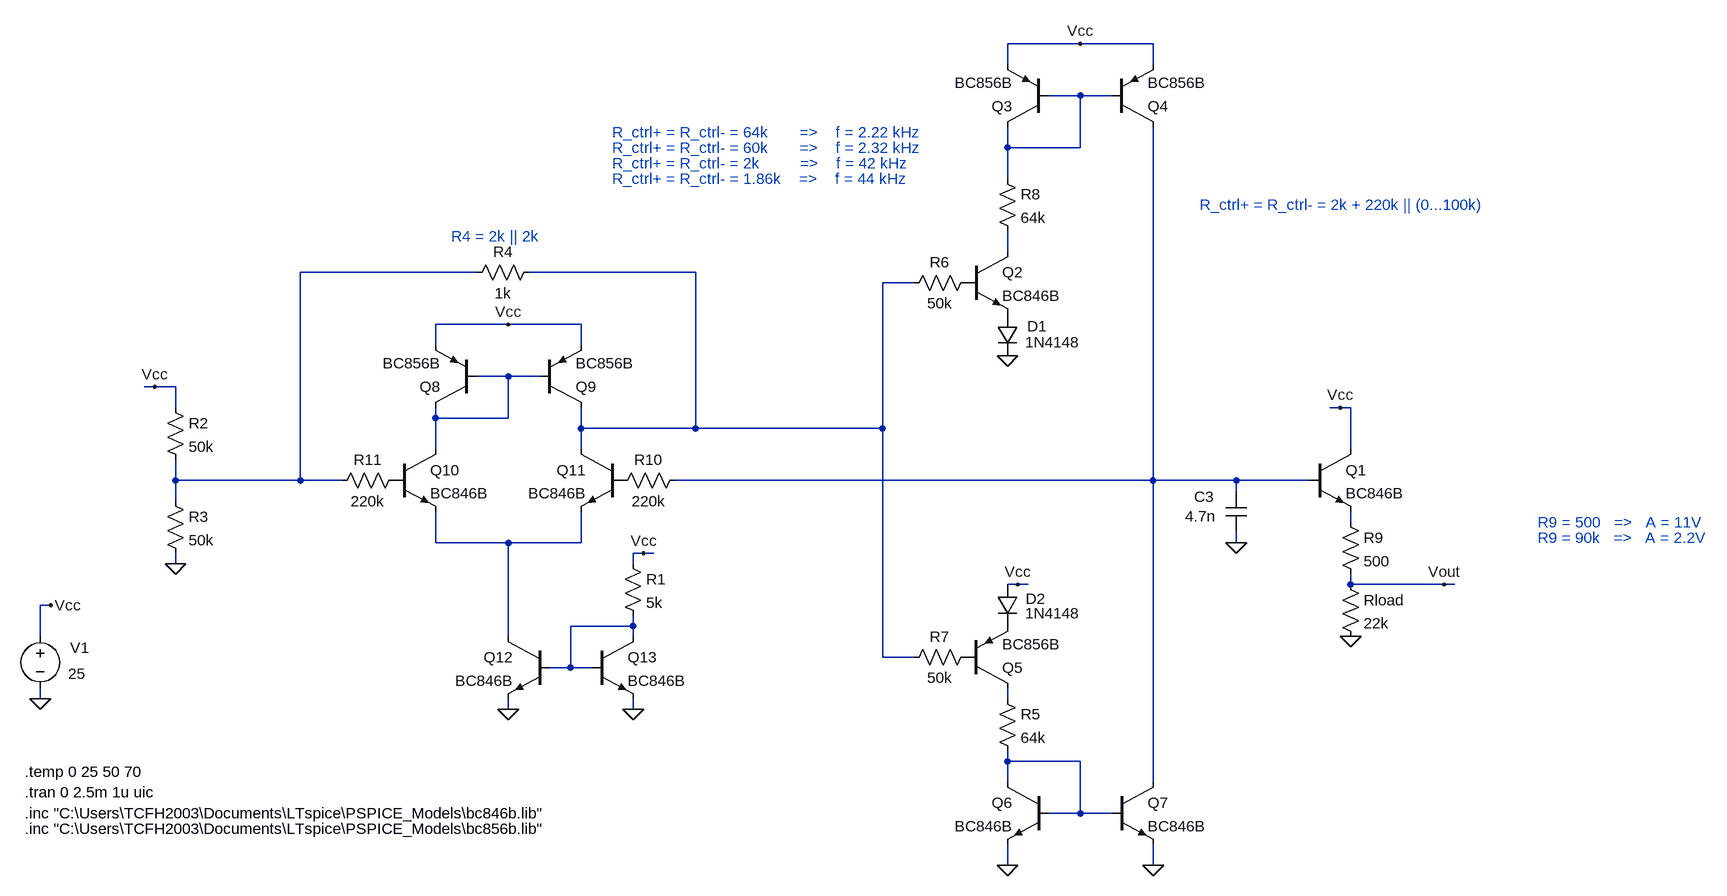
[diagram p0: schematic Proiect1_v5.asc]
Proiect1_v5.asc, the LTspice schematic file:
Version 4
SHEET 1 2096 956
WIRE 1088 -928 976 -928
WIRE 1200 -928 1088 -928
WIRE 976 -896 976 -928
WIRE 1200 -896 1200 -928
WIRE 1088 -848 1040 -848
WIRE 1136 -848 1088 -848
WIRE 976 -768 976 -800
WIRE 1088 -768 1088 -848
WIRE 1088 -768 976 -768
WIRE 976 -720 976 -768
WIRE 976 -608 976 -640
WIRE 160 -576 -112 -576
WIRE 496 -576 240 -576
WIRE 832 -560 784 -560
WIRE 208 -496 96 -496
WIRE 320 -496 208 -496
WIRE 96 -464 96 -496
WIRE 320 -464 320 -496
WIRE 208 -416 160 -416
WIRE 256 -416 208 -416
WIRE -336 -400 -352 -400
WIRE -304 -400 -336 -400
WIRE -304 -368 -304 -400
WIRE 1488 -368 1472 -368
WIRE 1504 -368 1488 -368
WIRE 96 -352 96 -368
WIRE 208 -352 208 -416
WIRE 208 -352 96 -352
WIRE 320 -336 320 -368
WIRE 496 -336 496 -576
WIRE 496 -336 320 -336
WIRE 784 -336 784 -560
WIRE 784 -336 496 -336
WIRE 96 -304 96 -352
WIRE 320 -304 320 -336
WIRE 1504 -304 1504 -368
WIRE -304 -256 -304 -288
WIRE -112 -256 -112 -576
WIRE -112 -256 -304 -256
WIRE -48 -256 -112 -256
WIRE 1200 -256 1200 -800
WIRE 1200 -256 464 -256
WIRE 1328 -256 1200 -256
WIRE 1440 -256 1328 -256
WIRE 1328 -240 1328 -256
WIRE -304 -224 -304 -256
WIRE 1504 -192 1504 -208
WIRE 96 -160 96 -208
WIRE 208 -160 96 -160
WIRE 320 -160 320 -208
WIRE 320 -160 208 -160
WIRE 1328 -160 1328 -176
WIRE 416 -144 400 -144
WIRE 432 -144 416 -144
WIRE -304 -128 -304 -144
WIRE 400 -128 400 -144
WIRE 992 -96 976 -96
WIRE 1008 -96 992 -96
WIRE 1504 -96 1504 -112
WIRE 1648 -96 1504 -96
WIRE 1664 -96 1648 -96
WIRE -496 -64 -512 -64
WIRE 400 -32 400 -48
WIRE 400 -32 304 -32
WIRE -512 -16 -512 -64
WIRE 208 -16 208 -160
WIRE 400 -16 400 -32
WIRE 784 16 784 -336
WIRE 832 16 784 16
WIRE 304 32 304 -32
WIRE 304 32 272 32
WIRE 336 32 304 32
WIRE -512 80 -512 64
WIRE 976 80 976 64
WIRE 208 96 208 80
WIRE 400 96 400 80
WIRE 976 176 976 160
WIRE 1088 176 976 176
WIRE 976 208 976 176
WIRE 1200 208 1200 -256
WIRE 1088 256 1088 176
WIRE 1088 256 1040 256
WIRE 1136 256 1088 256
WIRE 976 336 976 304
WIRE 1200 336 1200 304
FLAG -512 80 0
FLAG -496 -64 Vcc
FLAG 976 336 0
FLAG 1200 336 0
FLAG 1328 -160 0
FLAG 1504 -16 0
FLAG 1088 -928 Vcc
FLAG 416 -144 Vcc
FLAG 208 96 0
FLAG 400 96 0
FLAG 208 -496 Vcc
FLAG -304 -128 0
FLAG -336 -400 Vcc
FLAG 992 -96 Vcc
FLAG 1488 -368 Vcc
FLAG 1648 -96 Vout
FLAG 976 -448 0
SYMBOL voltage -512 -32 R0
WINDOW 0 46 33 Left 2
WINDOW 3 43 73 Left 2
WINDOW 123 0 0 Left 0
WINDOW 39 0 0 Left 0
SYMATTR InstName V1
SYMATTR Value 25
SYMBOL res 960 64 R0
SYMATTR InstName R5
SYMATTR Value 64k
SYMBOL cap 1344 -176 R180
WINDOW 0 50 55 Left 2
WINDOW 3 47 25 Left 2
SYMATTR InstName C3
SYMATTR Value 4.7n
SYMBOL res 1488 -112 R0
SYMATTR InstName Rload
SYMATTR Value 22k
SYMBOL res 960 -736 R0
SYMATTR InstName R8
SYMATTR Value 64k
SYMBOL res 384 -144 R0
SYMATTR InstName R1
SYMATTR Value 5k
SYMBOL res -320 -384 R0
SYMATTR InstName R2
SYMATTR Value 50k
SYMBOL res -320 -240 R0
SYMATTR InstName R3
SYMATTR Value 50k
SYMBOL res 256 -592 R90
WINDOW 0 0 56 VBottom 2
WINDOW 3 32 56 VTop 2
SYMATTR InstName R4
SYMATTR Value 1k
SYMBOL res 1488 -208 R0
SYMATTR InstName R9
SYMATTR Value 500
SYMBOL npn 1440 -304 R0
SYMATTR InstName Q1
SYMATTR Value BC846B
SYMBOL npn 912 -608 R0
SYMATTR InstName Q2
SYMATTR Value BC846B
SYMBOL pnp 1040 -800 R180
SYMATTR InstName Q3
SYMATTR Value BC856B
SYMBOL pnp 1136 -800 M180
SYMATTR InstName Q4
SYMATTR Value BC856B
SYMBOL pnp 912 64 M180
SYMATTR InstName Q5
SYMATTR Value BC856B
SYMBOL npn 1040 208 M0
SYMATTR InstName Q6
SYMATTR Value BC846B
SYMBOL npn 1136 208 R0
SYMATTR InstName Q7
SYMATTR Value BC846B
SYMBOL res 928 -576 R90
WINDOW 0 0 56 VBottom 2
WINDOW 3 32 56 VTop 2
SYMATTR InstName R6
SYMATTR Value 50k
SYMBOL res 928 0 R90
WINDOW 0 0 56 VBottom 2
WINDOW 3 32 56 VTop 2
SYMATTR InstName R7
SYMATTR Value 50k
SYMBOL pnp 160 -368 R180
SYMATTR InstName Q8
SYMATTR Value BC856B
SYMBOL pnp 256 -368 M180
SYMATTR InstName Q9
SYMATTR Value BC856B
SYMBOL npn 32 -304 R0
SYMATTR InstName Q10
SYMATTR Value BC846B
SYMBOL npn 384 -304 M0
SYMATTR InstName Q11
SYMATTR Value BC846B
SYMBOL npn 272 -16 M0
SYMATTR InstName Q12
SYMATTR Value BC846B
SYMBOL npn 336 -16 R0
SYMATTR InstName Q13
SYMATTR Value BC846B
SYMBOL res 480 -272 R90
WINDOW 0 0 56 VBottom 2
WINDOW 3 32 56 VTop 2
SYMATTR InstName R10
SYMATTR Value 220k
SYMBOL diode 960 -512 R0
WINDOW 0 46 19 Left 2
WINDOW 3 43 43 Left 2
SYMATTR InstName D1
SYMATTR Value 1N4148
SYMBOL diode 960 -96 R0
WINDOW 0 44 22 Left 2
WINDOW 3 43 44 Left 2
SYMATTR InstName D2
SYMATTR Value 1N4148
SYMBOL res 48 -272 R90
WINDOW 0 0 56 VBottom 2
WINDOW 3 32 56 VTop 2
SYMATTR InstName R11
SYMATTR Value 220k
TEXT -536 224 Left 2 !.tran 0 2.5m 1u uic
TEXT 368 -768 Left 2 ;R_ctrl+ = R_ctrl- = 60k       =>    f = 2.32 kHz
TEXT 368 -744 Left 2 ;R_ctrl+ = R_ctrl- = 2k         =>    f = 42 kHz
TEXT 1792 -192 Left 2 ;R9 = 500   =>   A = 11V
TEXT 1792 -168 Left 2 ;R9 = 90k   =>   A = 2.2V
TEXT -536 192 Left 2 !.temp 0 25 50 70
TEXT -536 256 Left 2 !.inc "C:\\Users\\TCFH2003\\Documents\\LTspice\\PSPICE_Models\\bc846b.lib"
TEXT -536 280 Left 2 !.inc "C:\\Users\\TCFH2003\\Documents\\LTspice\\PSPICE_Models\\bc856b.lib"
TEXT 368 -792 Left 2 ;R_ctrl+ = R_ctrl- = 64k       =>    f = 2.22 kHz
TEXT 368 -720 Left 2 ;R_ctrl+ = R_ctrl- = 1.86k    =>    f = 44 kHz
TEXT 120 -632 Left 2 ;R4 = 2k || 2k
TEXT 1272 -680 Left 2 ;R_ctrl+ = R_ctrl- = 2k + 220k || (0...100k)

The netlist it stands for:
* Proiect1_v5.asc
V1 Vcc 0 25
R5 N010 N011 64k
C3 0 N006 4.7n
Rload Vout 0 22k
R8 N001 N002 64k
R1 Vcc N009 5k
R2 Vcc N003 50k
R3 N003 0 50k
R4 N004 N003 1k
R9 N007 Vout 500
Q1 Vcc N006 N007 0 BC846B
Q2 N002 P001 P002 0 BC846B
Q3 N001 N001 Vcc 0 BC856B
Q4 N006 N001 Vcc 0 BC856B
Q5 N010 P003 P004 0 BC856B
Q6 N011 N011 0 0 BC846B
Q7 N006 N011 0 0 BC846B
R6 P001 N004 50k
R7 P003 N004 50k
Q8 N005 N005 Vcc 0 BC856B
Q9 N004 N005 Vcc 0 BC856B
Q10 N005 P005 N008 0 BC846B
Q11 N004 P006 N008 0 BC846B
Q12 N008 N009 0 0 BC846B
Q13 N009 N009 0 0 BC846B
R10 N006 P006 220k
D1 P002 0 1N4148
D2 Vcc P004 1N4148
R11 P005 N003 220k
.model D D
.lib standard.dio
.model NPN NPN
.model PNP PNP
.lib standard.bjt
.tran 0 2.5m 1u uic
* R_ctrl+ = R_ctrl- = 60k       =>    f = 2.32 kHz
* R_ctrl+ = R_ctrl- = 2k         =>    f = 42 kHz
* R9 = 500   =>   A = 11V
* R9 = 90k   =>   A = 2.2V
.temp 0 25 50 70
.inc "C:\Users\TCFH2003\Documents\LTspice\PSPICE_Models\bc846b.lib"
.inc "C:\Users\TCFH2003\Documents\LTspice\PSPICE_Models\bc856b.lib"
* R_ctrl+ = R_ctrl- = 64k       =>    f = 2.22 kHz
* R_ctrl+ = R_ctrl- = 1.86k    =>    f = 44 kHz
* R4 = 2k || 2k
* R_ctrl+ = R_ctrl- = 2k + 220k || (0...100k)
.backanno
.end